# Altium project PDB_V1.0_Mother.PrjPcb
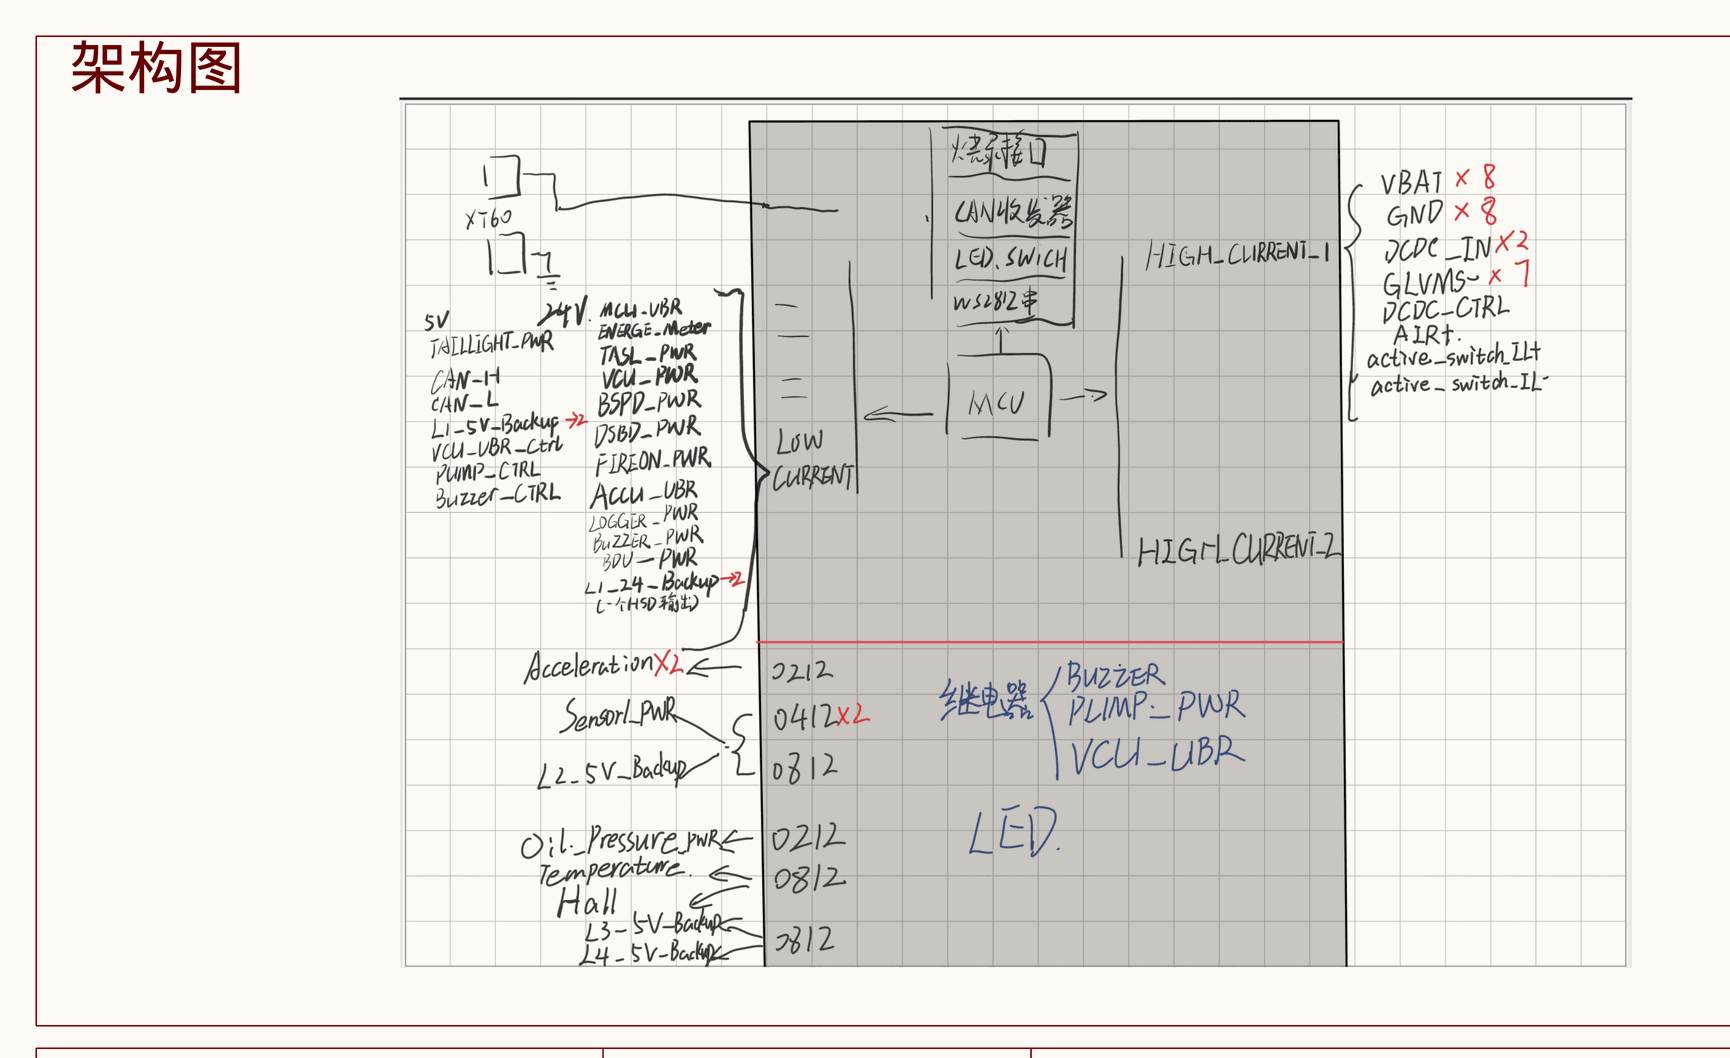
[diagram p0: PDB_Sheet2.SchDoc, top left]
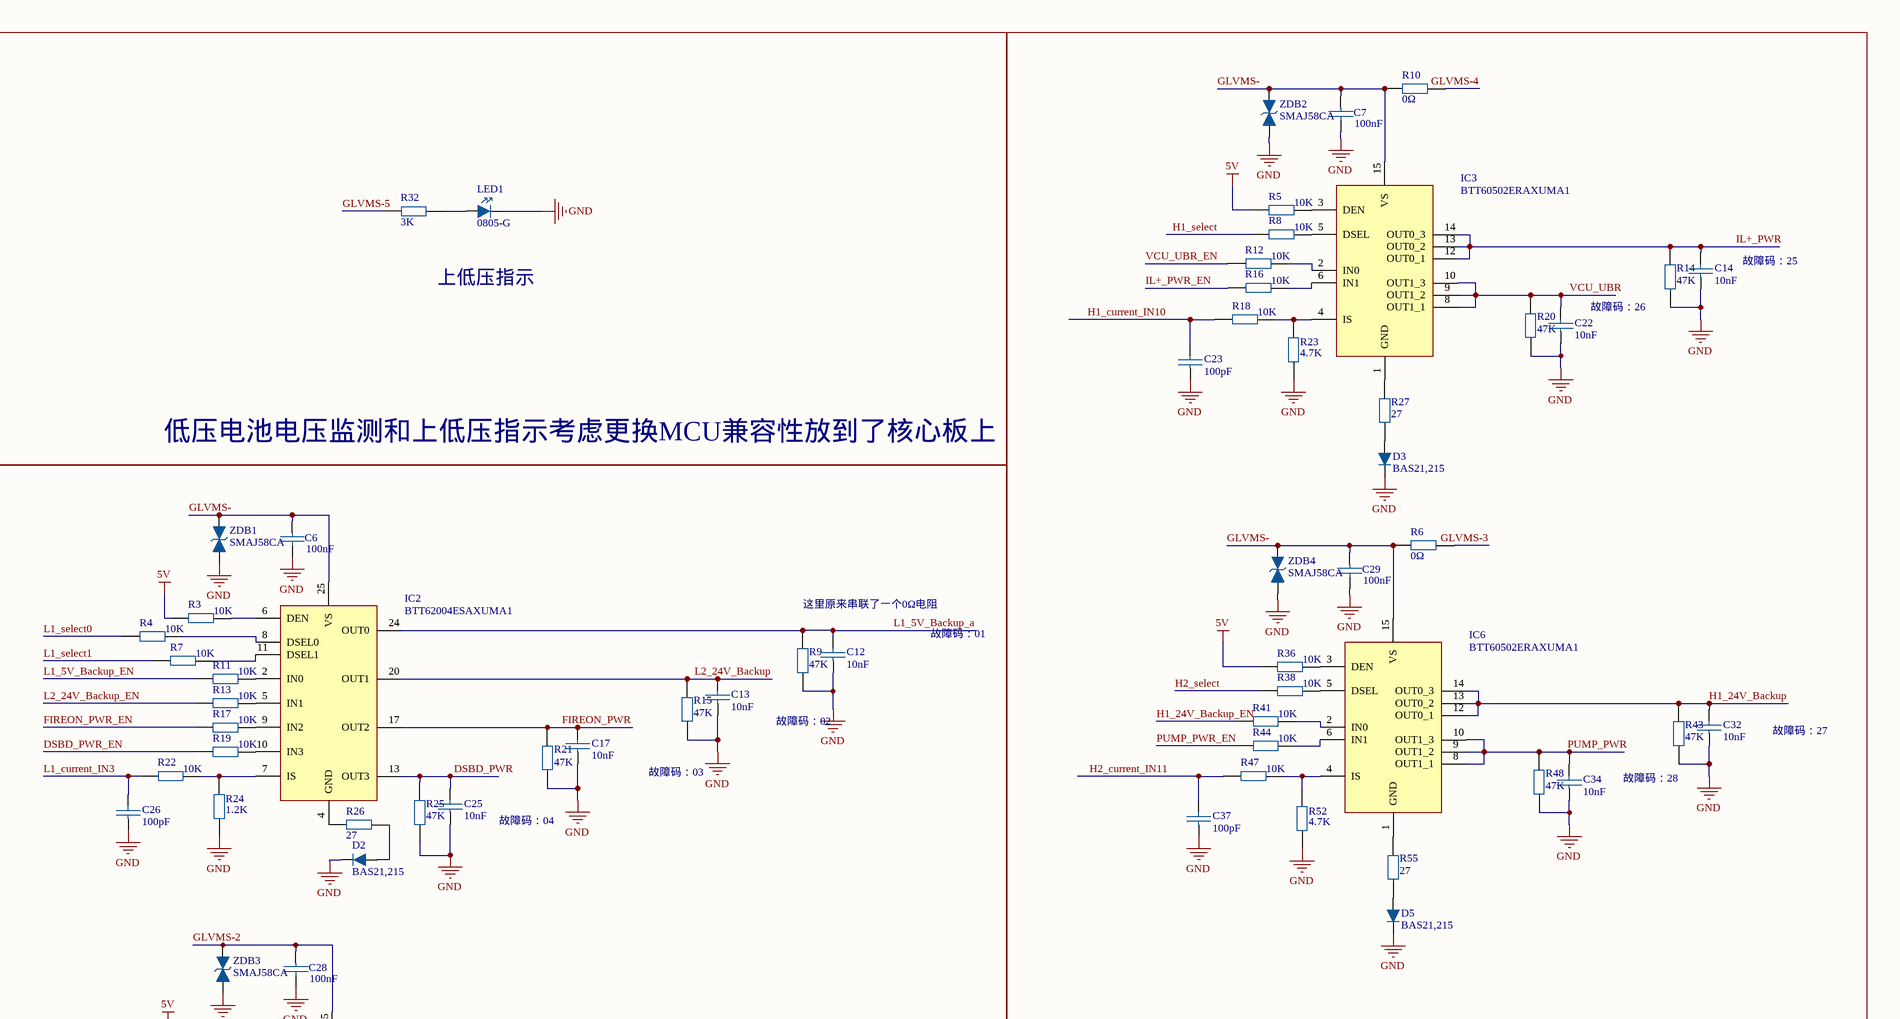
[diagram p1: PDB_Sheet2.SchDoc, top right]
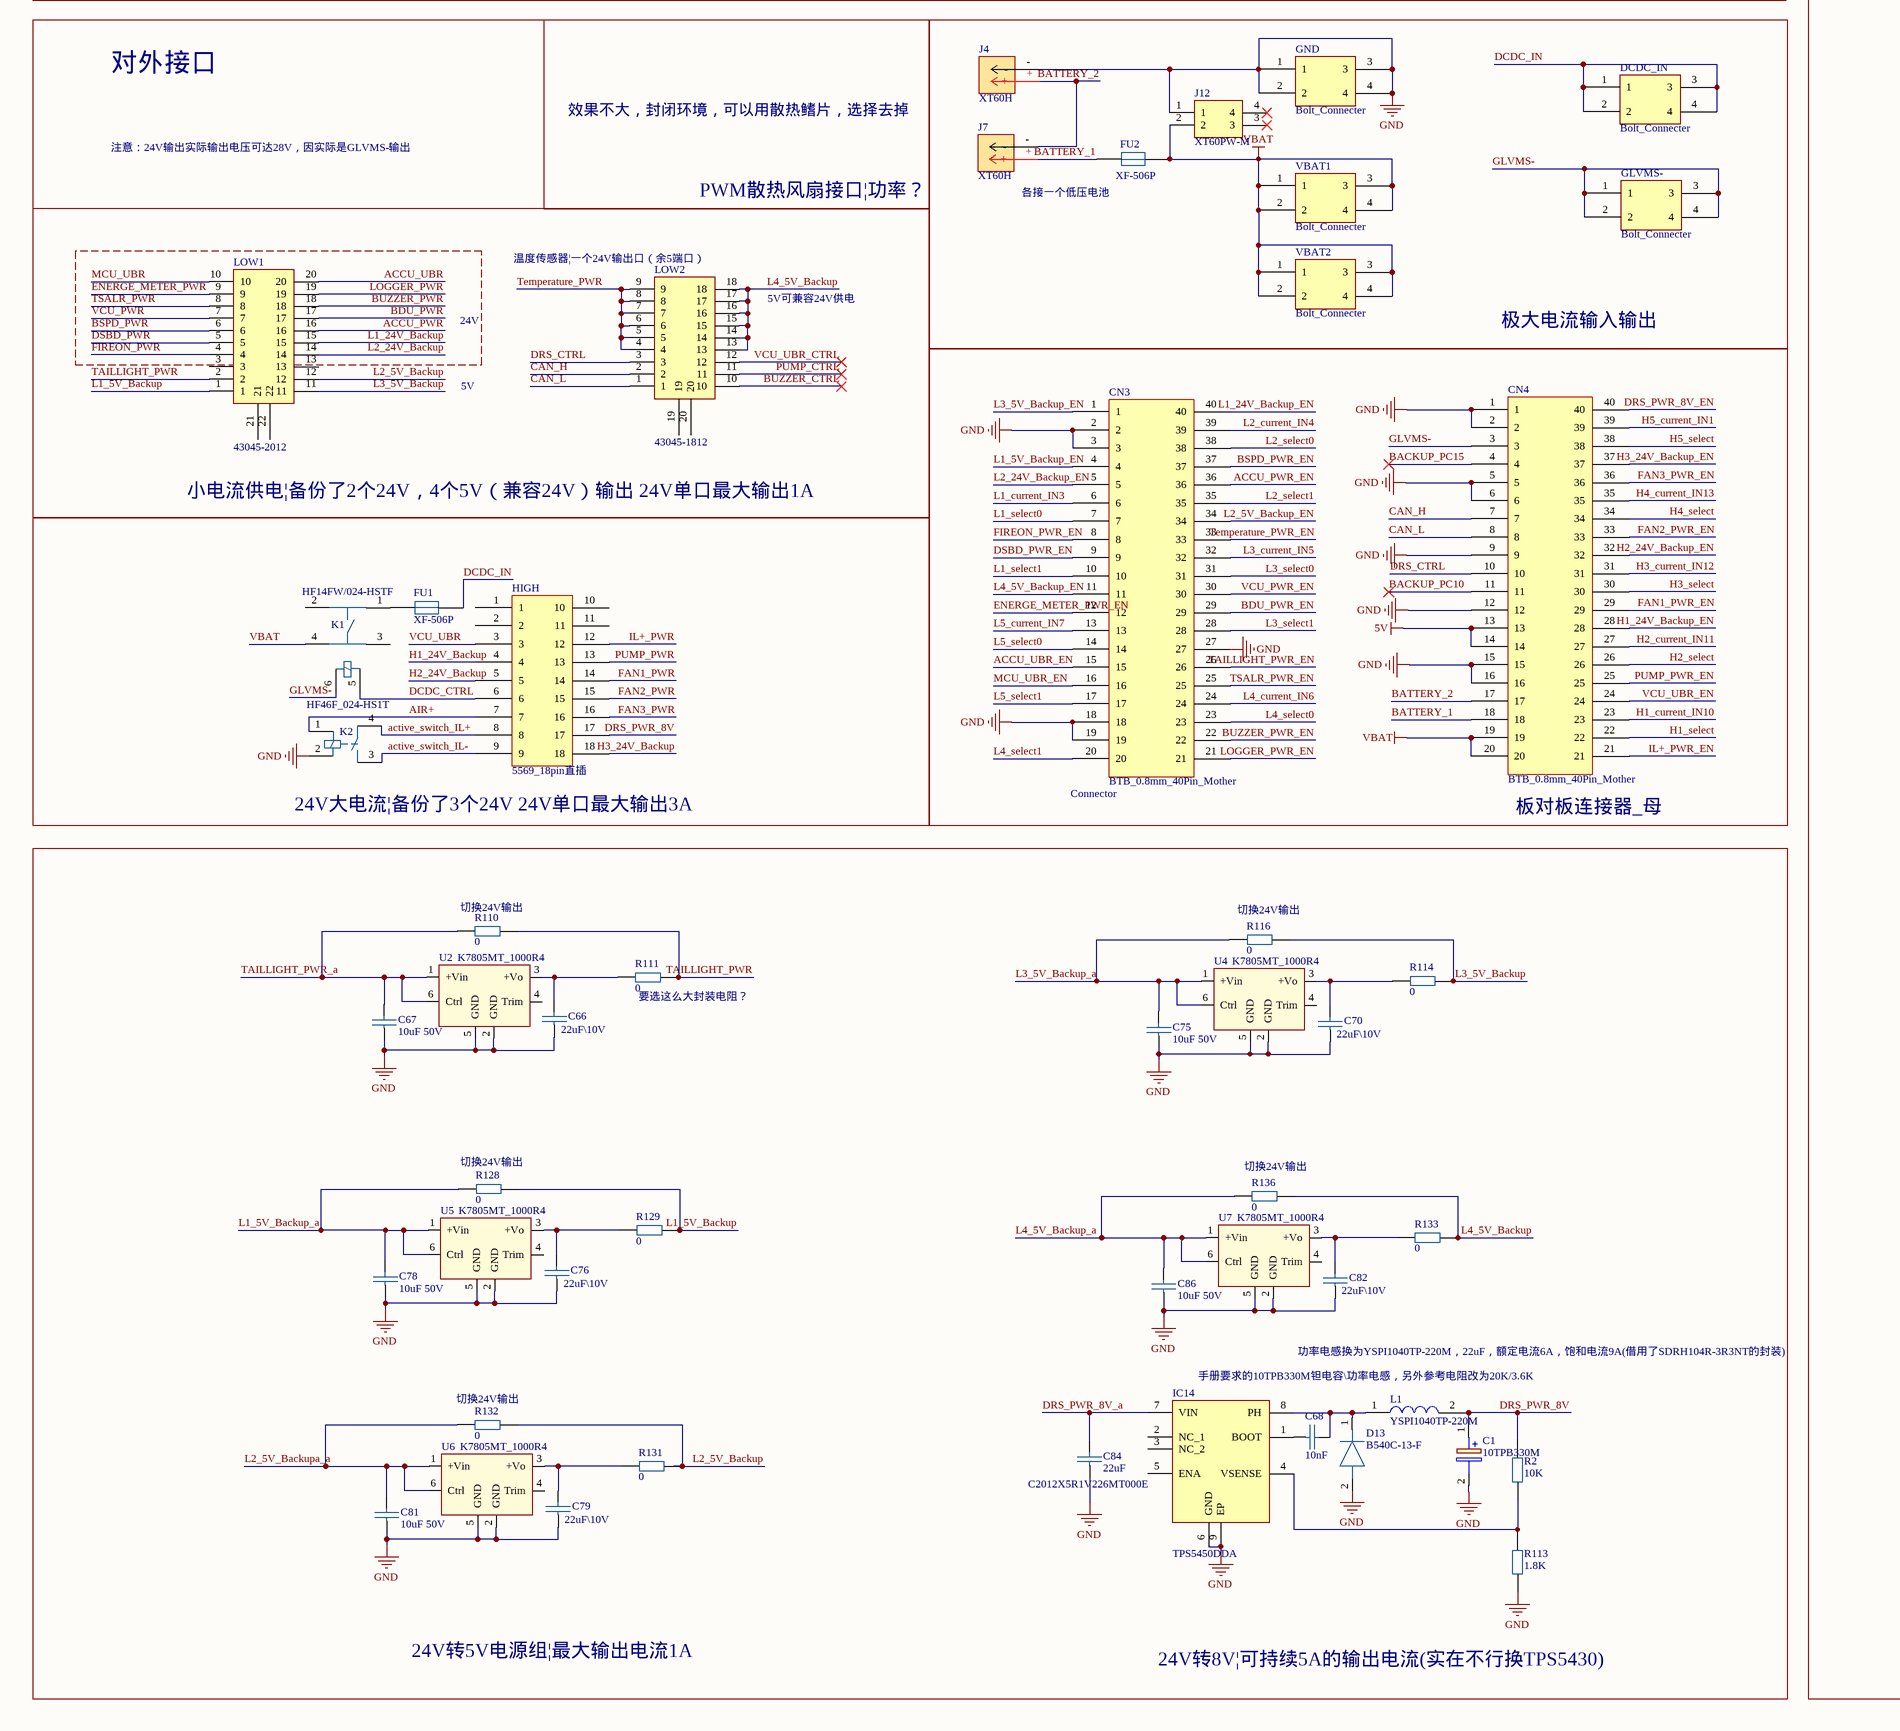
[diagram p2: PDB_Sheet2.SchDoc, bottom left]
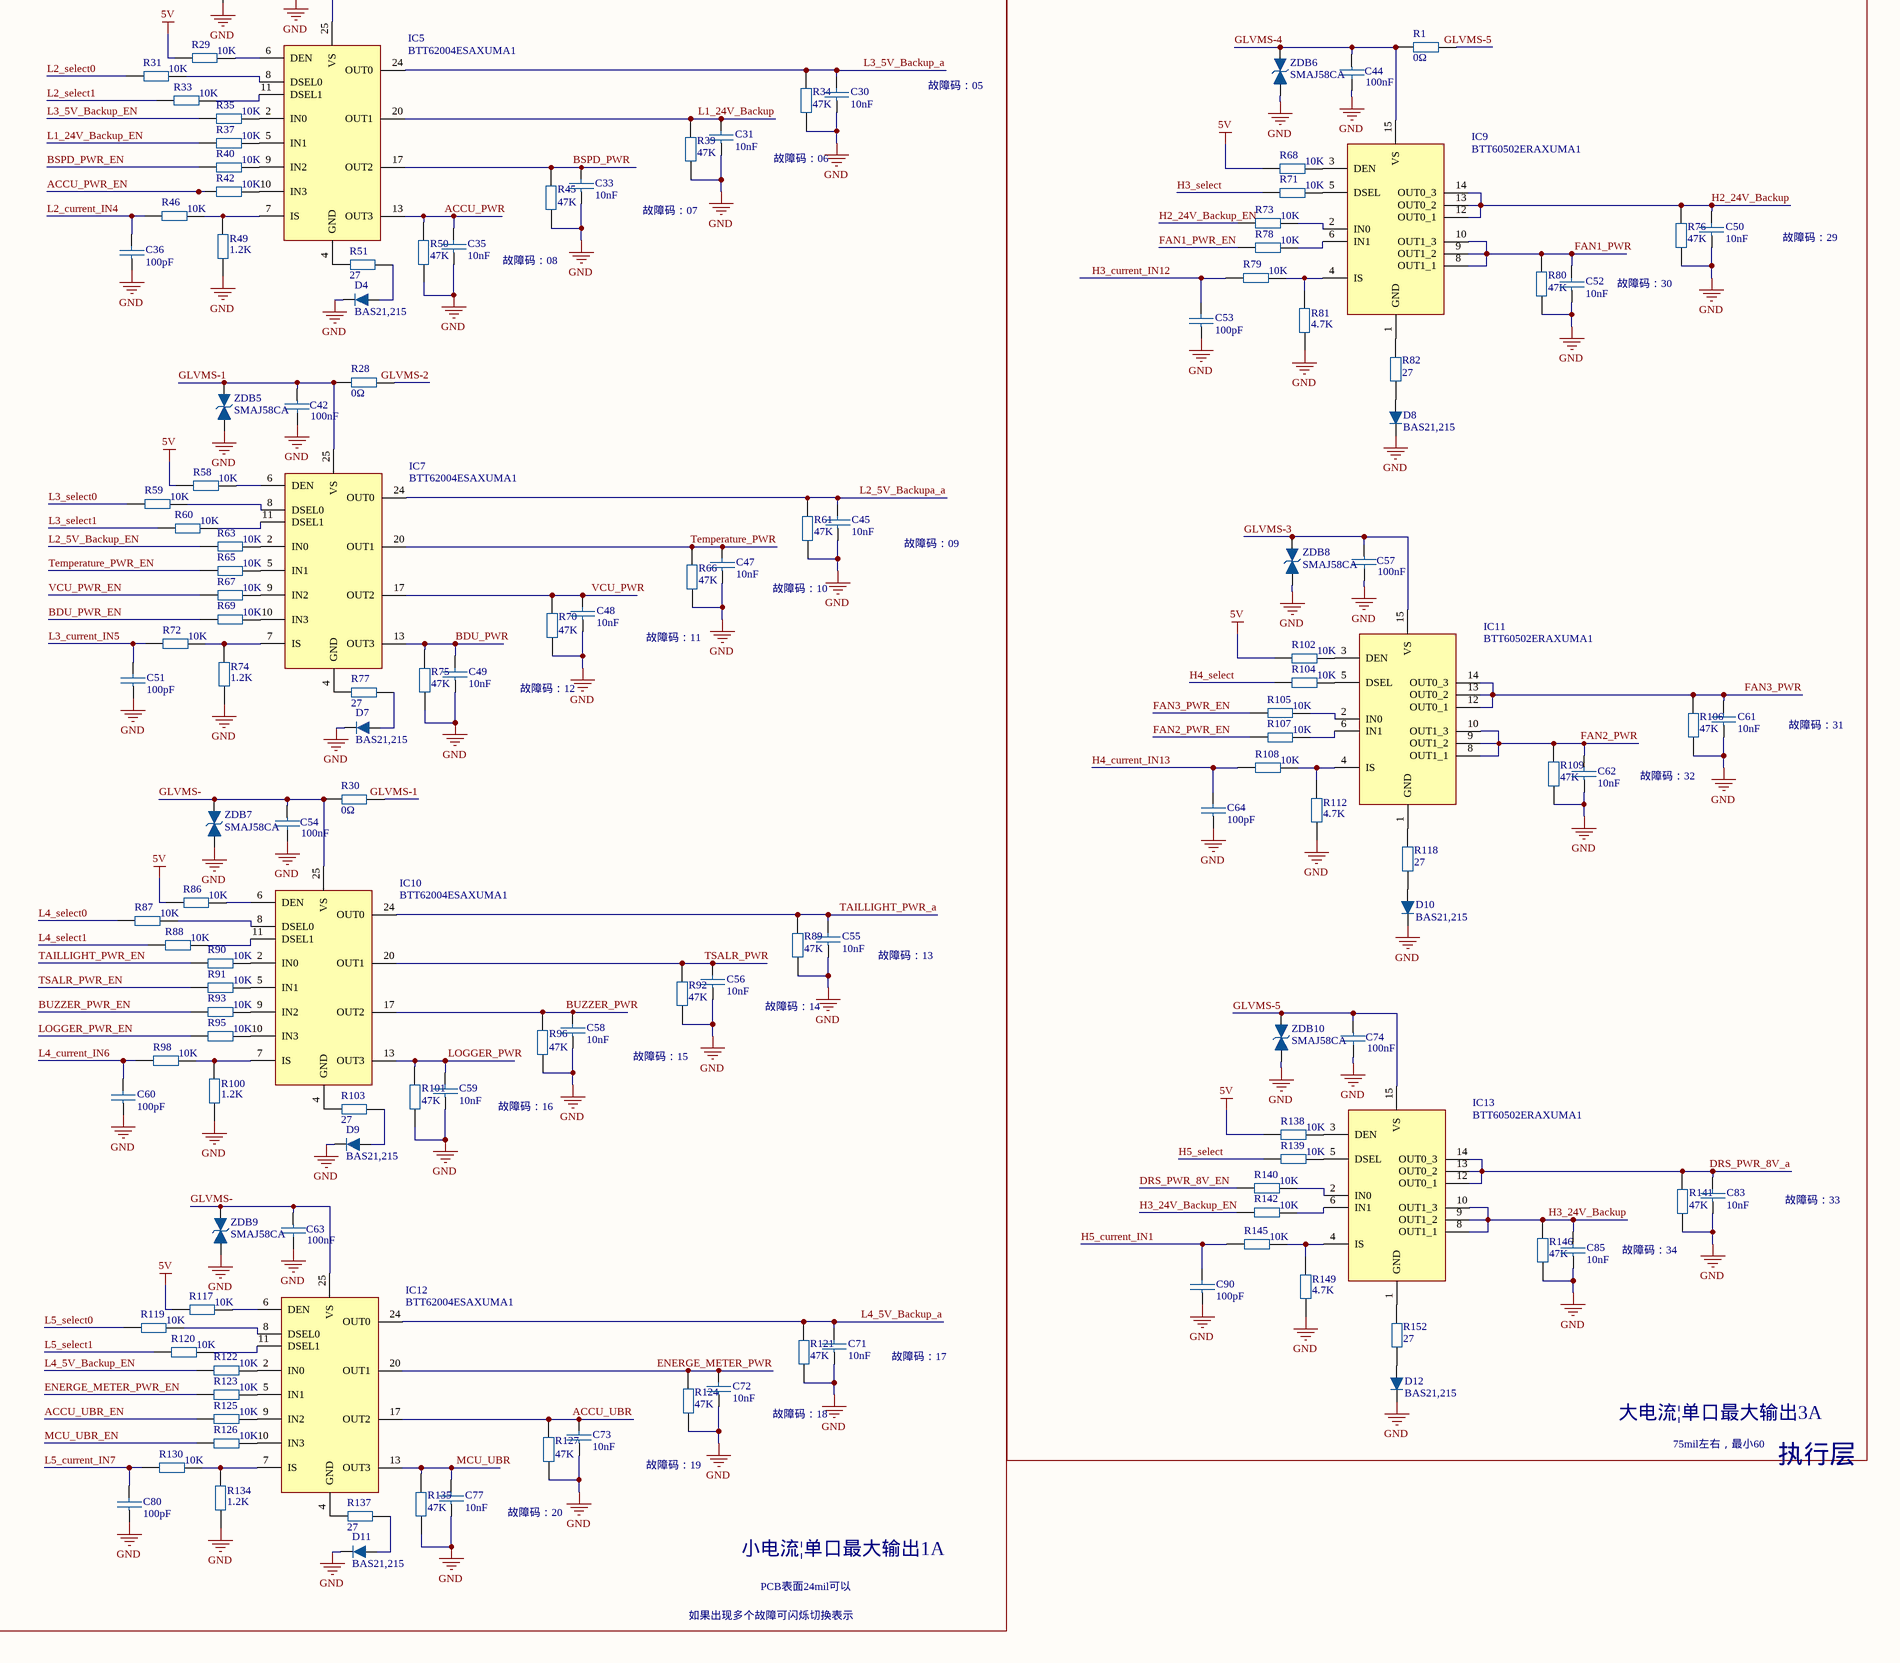
[diagram p3: PDB_Sheet2.SchDoc, bottom right]
1 sheet, 252 parts. Net scope: global (net labels, ports and power ports of the same name join across sheets).
Board file: PDB_PCB2.PcbDoc

## Sheet PDB_Sheet2.SchDoc: PDB1.0_Mother
size A1; SheetNumber: 1; SheetTotal: 1

### Parts
C1  10TPB330M  [POSCAP_D12_D15_D15E_D2E_D2_D3L_D4]
C6  100nF  [CAPC1608X08N__0603CAPUNPOLE]
C7  100nF  [CAPC1608X08N__0603CAPUNPOLE]
C12  10nF  [CAPC1608X08N__0603CAPUNPOLE]
C13  10nF  [CAPC1608X08N__0603CAPUNPOLE]
C14  10nF  [CAPC1608X08N__0603CAPUNPOLE]
C17  10nF  [CAPC1608X08N__0603CAPUNPOLE]
C22  10nF  [CAPC1608X08N__0603CAPUNPOLE]
C23  100pF  [CAPC1608X08N__0603CAPUNPOLE]
C25  10nF  [CAPC1608X08N__0603CAPUNPOLE]
C26  100pF  [CAPC1608X08N__0603CAPUNPOLE]
C28  100nF  [CAPC1608X08N__0603CAPUNPOLE]
C29  100nF  [CAPC1608X08N__0603CAPUNPOLE]
C30  10nF  [CAPC1608X08N__0603CAPUNPOLE]
C31  10nF  [CAPC1608X08N__0603CAPUNPOLE]
C32  10nF  [CAPC1608X08N__0603CAPUNPOLE]
C33  10nF  [CAPC1608X08N__0603CAPUNPOLE]
C34  10nF  [CAPC1608X08N__0603CAPUNPOLE]
C35  10nF  [CAPC1608X08N__0603CAPUNPOLE]
C36  100pF  [CAPC1608X08N__0603CAPUNPOLE]
C37  100pF  [CAPC1608X08N__0603CAPUNPOLE]
C42  100nF  [CAPC1608X08N__0603CAPUNPOLE]
C44  100nF  [CAPC1608X08N__0603CAPUNPOLE]
C45  10nF  [CAPC1608X08N__0603CAPUNPOLE]
C47  10nF  [CAPC1608X08N__0603CAPUNPOLE]
C48  10nF  [CAPC1608X08N__0603CAPUNPOLE]
C49  10nF  [CAPC1608X08N__0603CAPUNPOLE]
C50  10nF  [CAPC1608X08N__0603CAPUNPOLE]
C51  100pF  [CAPC1608X08N__0603CAPUNPOLE]
C52  10nF  [CAPC1608X08N__0603CAPUNPOLE]
C53  100pF  [CAPC1608X08N__0603CAPUNPOLE]
C54  100nF  [CAPC1608X08N__0603CAPUNPOLE]
C55  10nF  [CAPC1608X08N__0603CAPUNPOLE]
C56  10nF  [CAPC1608X08N__0603CAPUNPOLE]
C57  100nF  [CAPC1608X08N__0603CAPUNPOLE]
C58  10nF  [CAPC1608X08N__0603CAPUNPOLE]
C59  10nF  [CAPC1608X08N__0603CAPUNPOLE]
C60  100pF  [CAPC1608X08N__0603CAPUNPOLE]
C61  10nF  [CAPC1608X08N__0603CAPUNPOLE]
C62  10nF  [CAPC1608X08N__0603CAPUNPOLE]
C63  100nF  [CAPC1608X08N__0603CAPUNPOLE]
C64  100pF  [CAPC1608X08N__0603CAPUNPOLE]
C66  22uF\10V  [CAPC1608X08N__0603CAPUNPOLE]
C67  10uF 50V  [CAPC3216X16N_1206CAPUNPOLE]
C68  10nF  [CAPC1608X08N__0603CAPUNPOLE]
C70  22uF\10V  [CAPC1608X08N__0603CAPUNPOLE]
C71  10nF  [CAPC1608X08N__0603CAPUNPOLE]
C72  10nF  [CAPC1608X08N__0603CAPUNPOLE]
C73  10nF  [CAPC1608X08N__0603CAPUNPOLE]
C74  100nF  [CAPC1608X08N__0603CAPUNPOLE]
C75  10uF 50V  [CAPC3216X16N_1206CAPUNPOLE]
C76  22uF\10V  [CAPC1608X08N__0603CAPUNPOLE]
C77  10nF  [CAPC1608X08N__0603CAPUNPOLE]
C78  10uF 50V  [CAPC3216X16N_1206CAPUNPOLE]
C79  22uF\10V  [CAPC1608X08N__0603CAPUNPOLE]
C80  100pF  [CAPC1608X08N__0603CAPUNPOLE]
C81  10uF 50V  [CAPC3216X16N_1206CAPUNPOLE]
C82  22uF\10V  [CAPC1608X08N__0603CAPUNPOLE]
C83  10nF  [CAPC1608X08N__0603CAPUNPOLE]
C84  22uF  [CAPC2012X06N__0805CAPUNPOLE]
C85  10nF  [CAPC1608X08N__0603CAPUNPOLE]
C86  10uF 50V  [CAPC3216X16N_1206CAPUNPOLE]
C90  100pF  [CAPC1608X08N__0603CAPUNPOLE]
CN3  BTB_0.8mm_40Pin_Mother  System: Connector  [BTB_0.8mm_40PIN_M]
CN4  BTB_0.8mm_40Pin_Mother  [BTB_0.8mm_40PIN_M]
D2  BAS21,215  [BAS21215]
D3  BAS21,215  [BAS21215]
D4  BAS21,215  [BAS21215]
D5  BAS21,215  [BAS21215]
D7  BAS21,215  [BAS21215]
D8  BAS21,215  [BAS21215]
D9  BAS21,215  [BAS21215]
D10  BAS21,215  [BAS21215]
D11  BAS21,215  [BAS21215]
D12  BAS21,215  [BAS21215]
D13  B540C-13-F  [DIOM7959X250N]
DCDC_IN  Bolt_Connecter  [Bolt_Connecter]
FU1  XF-506P  [XF-506P]
FU2  XF-506P  [XF-506P]
GLVMS-  Bolt_Connecter  [Bolt_Connecter]
GND  Bolt_Connecter  [Bolt_Connecter]
HIGH  5569_18pin直插  [5569_18Pin]
IC2  BTT62004ESAXUMA1  [PG-TSDSO-24]
IC3  BTT60502ERAXUMA1  [PG-TDSO-14]
IC5  BTT62004ESAXUMA1  [PG-TSDSO-24]
IC6  BTT60502ERAXUMA1  [PG-TDSO-14]
IC7  BTT62004ESAXUMA1  [PG-TSDSO-24]
IC9  BTT60502ERAXUMA1  [PG-TDSO-14]
IC10  BTT62004ESAXUMA1  [PG-TSDSO-24]
IC11  BTT60502ERAXUMA1  [PG-TDSO-14]
IC12  BTT62004ESAXUMA1  [PG-TSDSO-24]
IC13  BTT60502ERAXUMA1  [PG-TDSO-14]
IC14  TPS5450DDA  [SOIC127P600X170-9N]
J4  XT60H  [AMASS_XT60_NOMAL]
J7  XT60H  [AMASS_XT60_NOMAL]
J12  XT60PW-M  [XT60PWM]
K1  HF14FW/024-HSTF  [HF14FW005HPTF]
K2  HF46F_024-HS1T  [HF46F024HS1T]
L1  YSPI1040TP-220M  [SDRH104R3R3NT]
LED1  0805-G  [DIOC2012X11N__0805DIO]
LOW1  43045-2012  [43045-20YY_121314]
LOW2  43045-1812  [43045-18YY_121314]
R1  0Ω  [RESC6432X06N__2512RES]
R2  10K  [RESC1608X04N_0603RES]
R3  10K  [RESC1608X04N_0603RES]
R4  10K  [RESC1608X04N_0603RES]
R5  10K  [RESC1608X04N_0603RES]
R6  0Ω  [RESC6432X06N__2512RES]
R7  10K  [RESC1608X04N_0603RES]
R8  10K  [RESC1608X04N_0603RES]
R9  47K  [RESC1608X04N_0603RES]
R10  0Ω  [RESC6432X06N__2512RES]
R11  10K  [RESC1608X04N_0603RES]
R12  10K  [RESC1608X04N_0603RES]
R13  10K  [RESC1608X04N_0603RES]
R14  47K  [RESC1608X04N_0603RES]
R15  47K  [RESC1608X04N_0603RES]
R16  10K  [RESC1608X04N_0603RES]
R17  10K  [RESC1608X04N_0603RES]
R18  10K  [RESC1608X04N_0603RES]
R19  10K  [RESC1608X04N_0603RES]
R20  47K  [RESC1608X04N_0603RES]
R21  47K  [RESC1608X04N_0603RES]
R22  10K  [RESC1608X04N_0603RES]
R23  4.7K  [RESC1608X04N_0603RES]
R24  1.2K  [RESC1608X04N_0603RES]
R25  47K  [RESC1608X04N_0603RES]
R26  27  [RESC1608X04N_0603RES]
R27  27  [RESC1608X04N_0603RES]
R28  0Ω  [RESC6432X06N__2512RES]
R29  10K  [RESC1608X04N_0603RES]
R30  0Ω  [RESC6432X06N__2512RES]
R31  10K  [RESC1608X04N_0603RES]
R32  3K  [RESC1608X04N_0603RES]
R33  10K  [RESC1608X04N_0603RES]
R34  47K  [RESC1608X04N_0603RES]
R35  10K  [RESC1608X04N_0603RES]
R36  10K  [RESC1608X04N_0603RES]
R37  10K  [RESC1608X04N_0603RES]
R38  10K  [RESC1608X04N_0603RES]
R39  47K  [RESC1608X04N_0603RES]
R40  10K  [RESC1608X04N_0603RES]
R41  10K  [RESC1608X04N_0603RES]
R42  10K  [RESC1608X04N_0603RES]
R43  47K  [RESC1608X04N_0603RES]
R44  10K  [RESC1608X04N_0603RES]
R45  47K  [RESC1608X04N_0603RES]
R46  10K  [RESC1608X04N_0603RES]
R47  10K  [RESC1608X04N_0603RES]
R48  47K  [RESC1608X04N_0603RES]
R49  1.2K  [RESC1608X04N_0603RES]
R50  47K  [RESC1608X04N_0603RES]
R51  27  [RESC1608X04N_0603RES]
R52  4.7K  [RESC1608X04N_0603RES]
R55  27  [RESC1608X04N_0603RES]
R58  10K  [RESC1608X04N_0603RES]
R59  10K  [RESC1608X04N_0603RES]
R60  10K  [RESC1608X04N_0603RES]
R61  47K  [RESC1608X04N_0603RES]
R63  10K  [RESC1608X04N_0603RES]
R65  10K  [RESC1608X04N_0603RES]
R66  47K  [RESC1608X04N_0603RES]
R67  10K  [RESC1608X04N_0603RES]
R68  10K  [RESC1608X04N_0603RES]
R69  10K  [RESC1608X04N_0603RES]
R70  47K  [RESC1608X04N_0603RES]
R71  10K  [RESC1608X04N_0603RES]
R72  10K  [RESC1608X04N_0603RES]
R73  10K  [RESC1608X04N_0603RES]
R74  1.2K  [RESC1608X04N_0603RES]
R75  47K  [RESC1608X04N_0603RES]
R76  47K  [RESC1608X04N_0603RES]
R77  27  [RESC1608X04N_0603RES]
R78  10K  [RESC1608X04N_0603RES]
R79  10K  [RESC1608X04N_0603RES]
R80  47K  [RESC1608X04N_0603RES]
R81  4.7K  [RESC1608X04N_0603RES]
R82  27  [RESC1608X04N_0603RES]
R86  10K  [RESC1608X04N_0603RES]
R87  10K  [RESC1608X04N_0603RES]
R88  10K  [RESC1608X04N_0603RES]
R89  47K  [RESC1608X04N_0603RES]
R90  10K  [RESC1608X04N_0603RES]
R91  10K  [RESC1608X04N_0603RES]
R92  47K  [RESC1608X04N_0603RES]
R93  10K  [RESC1608X04N_0603RES]
R95  10K  [RESC1608X04N_0603RES]
R96  47K  [RESC1608X04N_0603RES]
R98  10K  [RESC1608X04N_0603RES]
R100  1.2K  [RESC1608X04N_0603RES]
R101  47K  [RESC1608X04N_0603RES]
R102  10K  [RESC1608X04N_0603RES]
R103  27  [RESC1608X04N_0603RES]
R104  10K  [RESC1608X04N_0603RES]
R105  10K  [RESC1608X04N_0603RES]
R106  47K  [RESC1608X04N_0603RES]
R107  10K  [RESC1608X04N_0603RES]
R108  10K  [RESC1608X04N_0603RES]
R109  47K  [RESC1608X04N_0603RES]
R110  0  [RESC6432X06N__2512RES]
R111  0  [RESC6432X06N__2512RES]
R112  4.7K  [RESC1608X04N_0603RES]
R113  1.8K  [RESC1608X04N_0603RES]
R114  0  [RESC6432X06N__2512RES]
R116  0  [RESC6432X06N__2512RES]
R117  10K  [RESC1608X04N_0603RES]
R118  27  [RESC1608X04N_0603RES]
R119  10K  [RESC1608X04N_0603RES]
R120  10K  [RESC1608X04N_0603RES]
R121  47K  [RESC1608X04N_0603RES]
R122  10K  [RESC1608X04N_0603RES]
R123  10K  [RESC1608X04N_0603RES]
R124  47K  [RESC1608X04N_0603RES]
R125  10K  [RESC1608X04N_0603RES]
R126  10K  [RESC1608X04N_0603RES]
R127  47K  [RESC1608X04N_0603RES]
R128  0  [RESC6432X06N__2512RES]
R129  0  [RESC6432X06N__2512RES]
R130  10K  [RESC1608X04N_0603RES]
R131  0  [RESC6432X06N__2512RES]
R132  0  [RESC6432X06N__2512RES]
R133  0  [RESC6432X06N__2512RES]
R134  1.2K  [RESC1608X04N_0603RES]
R135  47K  [RESC1608X04N_0603RES]
R136  0  [RESC6432X06N__2512RES]
R137  27  [RESC1608X04N_0603RES]
R138  10K  [RESC1608X04N_0603RES]
R139  10K  [RESC1608X04N_0603RES]
R140  10K  [RESC1608X04N_0603RES]
R141  47K  [RESC1608X04N_0603RES]
R142  10K  [RESC1608X04N_0603RES]
R145  10K  [RESC1608X04N_0603RES]
R146  47K  [RESC1608X04N_0603RES]
R149  4.7K  [RESC1608X04N_0603RES]
R152  27  [RESC1608X04N_0603RES]
U2  K7805MT_1000R4  [K7805MT_500R4]
U4  K7805MT_1000R4  [K7805MT_500R4]
U5  K7805MT_1000R4  [K7805MT_500R4]
U6  K7805MT_1000R4  [K7805MT_500R4]
U7  K7805MT_1000R4  [K7805MT_500R4]
VBAT1  Bolt_Connecter  [Bolt_Connecter]
VBAT2  Bolt_Connecter  [Bolt_Connecter]
ZDB1  SMAJ58CA  [SMA/DO214AC-BIPOLAR]
ZDB2  SMAJ58CA  [SMA/DO214AC-BIPOLAR]
ZDB3  SMAJ58CA  [SMA/DO214AC-BIPOLAR]
ZDB4  SMAJ58CA  [SMA/DO214AC-BIPOLAR]
ZDB5  SMAJ58CA  [SMA/DO214AC-BIPOLAR]
ZDB6  SMAJ58CA  [SMA/DO214AC-BIPOLAR]
ZDB7  SMAJ58CA  [SMA/DO214AC-BIPOLAR]
ZDB8  SMAJ58CA  [SMA/DO214AC-BIPOLAR]
ZDB9  SMAJ58CA  [SMA/DO214AC-BIPOLAR]
ZDB10  SMAJ58CA  [SMA/DO214AC-BIPOLAR]

### Blocks framed on the sheet
低压电池电压监测和上低压指示考虑更换MCU兼容性放到了核心板上: LED1 R32
大电流¦单口最大输出3A: C7 C14 C22 C23 C29 C32 C34 C37 C44 C50 C52 C53 C57 C61 C62 C64 C74 C83 C85 C90 D3 D5 D8 D10 D12 IC3 IC6 IC9 IC11 IC13 R1 R5 R6 R8 R10 R12 R14 R16 R18 R20 R23 R27 R36 R38 R41 R43 R44 R47 R48 R52 R55 R68 R71 R73 R76 R78-R82 R102 R104-R109 R112 R118 R138-R142 R145 R146 R149 R152 ZDB2 ZDB4 ZDB6 ZDB8 ZDB10
小电流¦单口最大输出1A: C6 C12 C13 C17 C25 C26 C28 C30 C31 C33 C35 C36 C42 C45 C47-C49 C51 C54-C56 C58-C60 C63 C71-C73 C77 C80 D2 D4 D7 D9 D11 IC2 IC5 IC7 IC10 IC12 R3 R4 R7 R9 R11 R13 R15 R17 R19 R21 R22 R24-R26 R28-R31 R33-R35 R37 R39 R40 R42 R45 R46 R49-R51 R58-R61 R63 R65-R67 R69 R70 R72 R74 R75 R77 R86-R93 R95 R96 R98 R100 R101 R103 R117 R119-R127 R130 R134 R135 R137 ZDB1 ZDB3 ZDB5 ZDB7 ZDB9
对外接口: FU1 HIGH K1 K2 LOW2
极大电流输入输出: DCDC_IN FU2 GLVMS- GND J4 J7 J12 VBAT1 VBAT2
24V: LOW1
板对板连接器_母: CN3 CN4

### Nets
5V: CN4.13 CN4.14 R3.2 R5.2 R29.2 R36.2 R58.2 R68.2 R86.2 R102.2 R117.2 R138.2
GND: C1.2(-) C6.2 C7.2 C12.1 C13.1 C14.1 C17.1 C22.1 C23.1 C25.1 C26.1 C28.2 C29.2 C30.1 C31.1 C32.1 C33.1 C34.1 C35.1 C36.1 C37.1 C42.2 C44.2 C45.1 C47.1 C48.1 C49.1 C50.1 C51.1 C52.1 C53.1 C54.2 C55.1 C56.1 C57.2 C58.1 C59.1 C60.1 C61.1 C62.1 C63.2 C64.1 C66.1 C67.1 C70.1 C71.1 C72.1 C73.1 C74.2 C75.1 C76.1 C77.1 C78.1 C79.1 C80.1 C81.1 C82.1 C83.1 C84.1 C85.1 C86.1 C90.1 CN3.2 CN3.3 CN3.18 CN3.19 CN3.27 CN4.1 CN4.2 CN4.5 CN4.6 CN4.9 CN4.12 CN4.15 CN4.16 D2.3(K) D3.3(K) D4.3(K) D5.3(K) D7.3(K) D8.3(K) D9.3(K) D10.3(K) D11.3(K) D12.3(K) D13.2 GND.1 GND.2 GND.3 GND.4 IC14.6(GND) IC14.9(EP) J4.- J12.1 K2.2(COIL_2) LED1.1 R9.1 R14.1 R15.1 R20.1 R21.1 R23.1 R24.1 R25.1 R34.1 R39.1 R43.1 R45.1 R48.1 R49.1 R50.1 R52.1 R61.1 R66.1 R70.1 R74.1 R75.1 R76.1 R80.1 R81.1 R89.1 R92.1 R96.1 R100.1 R101.1 R106.1 R109.1 R112.1 R113.1 R121.1 R124.1 R127.1 R134.1 R135.1 R141.1 R146.1 R149.1 U2.2(GND) U2.5(GND) U4.2(GND) U4.5(GND) U5.2(GND) U5.5(GND) U6.2(GND) U6.5(GND) U7.2(GND) U7.5(GND) ZDB1.1 ZDB2.1 ZDB3.1 ZDB4.1 ZDB5.1 ZDB6.1 ZDB7.1 ZDB8.1 ZDB9.1 ZDB10.1
VBAT: CN4.19 CN4.20 FU2.2 J12.2 K1.4(COM_2) VBAT1.1 VBAT1.2 VBAT1.3 VBAT1.4 VBAT2.1 VBAT2.2 VBAT2.3 VBAT2.4
ACCU_PWR: C35.2 IC5.13(OUT3) LOW1.16 R50.2
ACCU_PWR_EN: CN3.36 R42.2
ACCU_UBR: C73.2 IC12.17(OUT2) LOW1.20 R127.2
ACCU_UBR_EN: CN3.15 R125.2
active_switch_IL+: HIGH.8 K2.4(COM)
active_switch_IL-: HIGH.9 K2.3(NO)
AIR+: HIGH.7 K2.1(COIL_1)
BACKUP_PC10: CN4.11
BACKUP_PC15: CN4.4
BATTERY_1: CN4.18 FU2.1 J7.+
BATTERY_2: CN4.17 J4.+ J7.-
BDU_PWR: C49.2 IC7.13(OUT3) LOW1.17 R75.2
BDU_PWR_EN: CN3.29 R69.2
BSPD_PWR: C33.2 IC5.17(OUT2) LOW1.6 R45.2
BSPD_PWR_EN: CN3.37 R40.2
BUZZER_CTRL: LOW2.10
BUZZER_PWR: C58.2 IC10.17(OUT2) LOW1.18 R96.2
BUZZER_PWR_EN: CN3.22 R93.2
CAN_H: CN4.7 LOW2.2
CAN_L: CN4.8 LOW2.1
DCDC_CTRL: HIGH.6 K1.5(COIL_1)
DCDC_IN: DCDC_IN.1 DCDC_IN.2 DCDC_IN.3 DCDC_IN.4 FU1.1
DRS_CTRL: CN4.10 LOW2.3
DRS_PWR_8V: C1.1(+) HIGH.17 L1.2 R2.2
DRS_PWR_8V_a: C83.2 C84.2 IC13.12(OUT0_1) IC13.13(OUT0_2) IC13.14(OUT0_3) IC14.7(VIN) R141.2
DRS_PWR_8V_EN: CN4.40 R140.2
DSBD_PWR: C25.2 IC2.13(OUT3) LOW1.5 R25.2
DSBD_PWR_EN: CN3.9 R19.2
ENERGE_METER_PWR: C72.2 IC12.20(OUT1) LOW1.9 R124.2
ENERGE_METER_PWR_EN: CN3.12 R123.2
FAN1_PWR: C52.2 HIGH.14 IC9.8(OUT1_1) IC9.9(OUT1_2) IC9.10(OUT1_3) R80.2
FAN1_PWR_EN: CN4.29 R78.2
FAN2_PWR: C62.2 HIGH.15 IC11.8(OUT1_1) IC11.9(OUT1_2) IC11.10(OUT1_3) R109.2
FAN2_PWR_EN: CN4.33 R107.2
FAN3_PWR: C61.2 HIGH.16 IC11.12(OUT0_1) IC11.13(OUT0_2) IC11.14(OUT0_3) R106.2
FAN3_PWR_EN: CN4.36 R105.2
FIREON_PWR: C17.2 IC2.17(OUT2) LOW1.4 R21.2
FIREON_PWR_EN: CN3.8 R17.2
GLVMS-: C6.1 C7.1 C29.1 C54.1 C63.1 CN4.3 GLVMS-.1 GLVMS-.2 GLVMS-.3 GLVMS-.4 IC2.25(VS) IC3.15(VS) IC6.15(VS) IC10.25(VS) IC12.25(VS) K1.6(COIL_2) R6.1 R10.1 R30.1 ZDB1.2 ZDB2.2 ZDB4.2 ZDB7.2 ZDB9.2
GLVMS-1: C42.1 IC7.25(VS) R28.1 R30.2 ZDB5.2
GLVMS-2: C28.1 IC5.25(VS) R28.2 ZDB3.2
GLVMS-3: C57.1 IC11.15(VS) R6.2 ZDB8.2
GLVMS-4: C44.1 IC9.15(VS) R1.1 R10.2 ZDB6.2
GLVMS-5: C74.1 IC13.15(VS) R1.2 R32.2 ZDB10.2
H1_24V_Backup: C32.2 HIGH.4 IC6.12(OUT0_1) IC6.13(OUT0_2) IC6.14(OUT0_3) R43.2
H1_24V_Backup_EN: CN4.28 R41.2
H1_current_IN10: C23.2 CN4.23 R18.2
H1_select: CN4.22 R8.2
H2_24V_Backup: C50.2 HIGH.5 IC9.12(OUT0_1) IC9.13(OUT0_2) IC9.14(OUT0_3) R76.2
H2_24V_Backup_EN: CN4.32 R73.2
H2_current_IN11: C37.2 CN4.27 R47.2
H2_select: CN4.26 R38.2
H3_24V_Backup: C85.2 HIGH.18 IC13.8(OUT1_1) IC13.9(OUT1_2) IC13.10(OUT1_3) R146.2
H3_24V_Backup_EN: CN4.37 R142.2
H3_current_IN12: C53.2 CN4.31 R79.2
H3_select: CN4.30 R71.2
H4_current_IN13: C64.2 CN4.35 R108.2
H4_select: CN4.34 R104.2
H5_current_IN1: C90.2 CN4.39 R145.2
H5_select: CN4.38 R139.2
IL+_PWR: C14.2 HIGH.12 IC3.12(OUT0_1) IC3.13(OUT0_2) IC3.14(OUT0_3) R14.2
IL+_PWR_EN: CN4.21 R16.2
L1_5V_Backup: LOW1.1 R128.2 R129.2
L1_5V_Backup_a: C12.2 C78.2 IC2.24(OUT0) R9.2 R128.1 U5.1(+Vin) U5.6(Ctrl)
L1_5V_Backup_EN: CN3.4 R11.2
L1_24V_Backup: C31.2 IC5.20(OUT1) LOW1.15 R39.2
L1_24V_Backup_EN: CN3.40 R37.2
L1_current_IN3: C26.2 CN3.6 R22.2
L1_select0: CN3.7 R4.2
L1_select1: CN3.10 R7.2
L2_5V_Backup: LOW1.12 R131.2 R132.2
L2_5V_Backup_EN: CN3.34 R63.2
L2_5V_Backupa_a: C45.2 C81.2 IC7.24(OUT0) R61.2 R132.1 U6.1(+Vin) U6.6(Ctrl)
L2_24V_Backup: C13.2 IC2.20(OUT1) LOW1.14 R15.2
L2_24V_Backup_EN: CN3.5 R13.2
L2_current_IN4: C36.2 CN3.39 R46.2
L2_select0: CN3.38 R31.2
L2_select1: CN3.35 R33.2
L3_5V_Backup: LOW1.11 R114.2 R116.2
L3_5V_Backup_a: C30.2 C75.2 IC5.24(OUT0) R34.2 R116.1 U4.1(+Vin) U4.6(Ctrl)
L3_5V_Backup_EN: CN3.1 R35.2
L3_current_IN5: C51.2 CN3.32 R72.2
L3_select0: CN3.31 R59.2
L3_select1: CN3.28 R60.2
L4_5V_Backup: LOW2.13 LOW2.14 LOW2.15 LOW2.16 LOW2.17 LOW2.18 R133.2 R136.2
L4_5V_Backup_a: C71.2 C86.2 IC12.24(OUT0) R121.2 R136.1 U7.1(+Vin) U7.6(Ctrl)
L4_5V_Backup_EN: CN3.11 R122.2
L4_current_IN6: C60.2 CN3.24 R98.2
L4_select0: CN3.23 R87.2
L4_select1: CN3.20 R88.2
L5_current_IN7: C80.2 CN3.13 R130.2
L5_select0: CN3.14 R119.2
L5_select1: CN3.17 R120.2
LOGGER_PWR: C59.2 IC10.13(OUT3) LOW1.19 R101.2
LOGGER_PWR_EN: CN3.21 R95.2
MCU_UBR: C77.2 IC12.13(OUT3) LOW1.10 R135.2
MCU_UBR_EN: CN3.16 R126.2
PUMP_CTRL: LOW2.11
PUMP_PWR: C34.2 HIGH.13 IC6.8(OUT1_1) IC6.9(OUT1_2) IC6.10(OUT1_3) R48.2
PUMP_PWR_EN: CN4.25 R44.2
TAILLIGHT_PWR: LOW1.2 R110.2 R111.2
TAILLIGHT_PWR_a: C55.2 C67.2 IC10.24(OUT0) R89.2 R110.1 U2.1(+Vin) U2.6(Ctrl)
TAILLIGHT_PWR_EN: CN3.26 R90.2
Temperature_PWR: C47.2 IC7.20(OUT1) LOW2.4 LOW2.5 LOW2.6 LOW2.7 LOW2.8 LOW2.9 R66.2
Temperature_PWR_EN: CN3.33 R65.2
TSALR_PWR: C56.2 IC10.20(OUT1) LOW1.8 R92.2
TSALR_PWR_EN: CN3.25 R91.2
VCU_PWR: C48.2 IC7.17(OUT2) LOW1.7 R70.2
VCU_PWR_EN: CN3.30 R67.2
VCU_UBR: C22.2 HIGH.3 IC3.8(OUT1_1) IC3.9(OUT1_2) IC3.10(OUT1_3) R20.2
VCU_UBR_CTRL: LOW2.12
VCU_UBR_EN: CN4.24 R12.2
NetC66_2: C66.2 R111.1 U2.3(+Vo)
NetC68_1: C68.1 IC14.1(BOOT)
NetC68_2: C68.2 D13.1 IC14.8(PH) L1.1
NetC70_2: C70.2 R114.1 U4.3(+Vo)
NetC76_2: C76.2 R129.1 U5.3(+Vo)
NetC79_2: C79.2 R131.1 U6.3(+Vo)
NetC82_2: C82.2 R133.1 U7.3(+Vo)
NetD2_1: D2.1(A) R26.1
NetD3_1: D3.1(A) R27.2
NetD4_1: D4.1(A) R51.1
NetD5_1: D5.1(A) R55.2
NetD7_1: D7.1(A) R77.1
NetD8_1: D8.1(A) R82.2
NetD9_1: D9.1(A) R103.1
NetD10_1: D10.1(A) R118.2
NetD11_1: D11.1(A) R137.1
NetD12_1: D12.1(A) R152.2
NetFU1_2: FU1.2 K1.1(NO_1)
NetIC2_2: IC2.2(IN0) R11.1
NetIC2_4: IC2.4(GND) R26.2
NetIC2_5: IC2.5(IN1) R13.1
NetIC2_6: IC2.6(DEN) R3.1
NetIC2_7: IC2.7(IS) R22.1 R24.2
NetIC2_8: IC2.8(DSEL0) R4.1
NetIC2_9: IC2.9(IN2) R17.1
NetIC2_10: IC2.10(IN3) R19.1
NetIC2_11: IC2.11(DSEL1) R7.1
NetIC3_1: IC3.1(GND) R27.1
NetIC3_2: IC3.2(IN0) R12.1
NetIC3_3: IC3.3(DEN) R5.1
NetIC3_4: IC3.4(IS) R18.1 R23.2
NetIC3_5: IC3.5(DSEL) R8.1
NetIC3_6: IC3.6(IN1) R16.1
NetIC5_2: IC5.2(IN0) R35.1
NetIC5_4: IC5.4(GND) R51.2
NetIC5_5: IC5.5(IN1) R37.1
NetIC5_6: IC5.6(DEN) R29.1
NetIC5_7: IC5.7(IS) R46.1 R49.2
NetIC5_8: IC5.8(DSEL0) R31.1
NetIC5_9: IC5.9(IN2) R40.1
NetIC5_10: IC5.10(IN3) R42.1
NetIC5_11: IC5.11(DSEL1) R33.1
NetIC6_1: IC6.1(GND) R55.1
NetIC6_2: IC6.2(IN0) R41.1
NetIC6_3: IC6.3(DEN) R36.1
NetIC6_4: IC6.4(IS) R47.1 R52.2
NetIC6_5: IC6.5(DSEL) R38.1
NetIC6_6: IC6.6(IN1) R44.1
NetIC7_2: IC7.2(IN0) R63.1
NetIC7_4: IC7.4(GND) R77.2
NetIC7_5: IC7.5(IN1) R65.1
NetIC7_6: IC7.6(DEN) R58.1
NetIC7_7: IC7.7(IS) R72.1 R74.2
NetIC7_8: IC7.8(DSEL0) R59.1
NetIC7_9: IC7.9(IN2) R67.1
NetIC7_10: IC7.10(IN3) R69.1
NetIC7_11: IC7.11(DSEL1) R60.1
NetIC9_1: IC9.1(GND) R82.1
NetIC9_2: IC9.2(IN0) R73.1
NetIC9_3: IC9.3(DEN) R68.1
NetIC9_4: IC9.4(IS) R79.1 R81.2
NetIC9_5: IC9.5(DSEL) R71.1
NetIC9_6: IC9.6(IN1) R78.1
NetIC10_2: IC10.2(IN0) R90.1
NetIC10_4: IC10.4(GND) R103.2
NetIC10_5: IC10.5(IN1) R91.1
NetIC10_6: IC10.6(DEN) R86.1
NetIC10_7: IC10.7(IS) R98.1 R100.2
NetIC10_8: IC10.8(DSEL0) R87.1
NetIC10_9: IC10.9(IN2) R93.1
NetIC10_10: IC10.10(IN3) R95.1
NetIC10_11: IC10.11(DSEL1) R88.1
NetIC11_1: IC11.1(GND) R118.1
NetIC11_2: IC11.2(IN0) R105.1
NetIC11_3: IC11.3(DEN) R102.1
NetIC11_4: IC11.4(IS) R108.1 R112.2
NetIC11_5: IC11.5(DSEL) R104.1
NetIC11_6: IC11.6(IN1) R107.1
NetIC12_2: IC12.2(IN0) R122.1
NetIC12_4: IC12.4(GND) R137.2
NetIC12_5: IC12.5(IN1) R123.1
NetIC12_6: IC12.6(DEN) R117.1
NetIC12_7: IC12.7(IS) R130.1 R134.2
NetIC12_8: IC12.8(DSEL0) R119.1
NetIC12_9: IC12.9(IN2) R125.1
NetIC12_10: IC12.10(IN3) R126.1
NetIC12_11: IC12.11(DSEL1) R120.1
NetIC13_1: IC13.1(GND) R152.1
NetIC13_2: IC13.2(IN0) R140.1
NetIC13_3: IC13.3(DEN) R138.1
NetIC13_4: IC13.4(IS) R145.1 R149.2
NetIC13_5: IC13.5(DSEL) R139.1
NetIC13_6: IC13.6(IN1) R142.1
NetIC14_4: IC14.4(VSENSE) R2.1 R113.2
NetLED1_2: LED1.2 R32.1

Not connected (* = marked no-connect by the designer): HIGH 1 2 10 11; IC14 2(NC_1) 3(NC_2) 5(ENA); J12 3* 4*; K1 2(NO_2) 3(COM_1); LOW1 3 13 21 22; LOW2 19 20; U2 4(Trim); U4 4(Trim); U5 4(Trim); U6 4(Trim); U7 4(Trim)

### Notes on the sheet
- 架构图
- (near C14) 故障码：25
- 上低压指示
- (near C22) 故障码：26
- 这里原来串联了一个0Ω电阻
- 故障码：01
- 故障码：02
- 故障码：27
- 故障码：03
- 故障码：28
- 故障码：04
- 效果不大，封闭环境，可以用散热鳍片，选择去掉
- 注意：24V输出实际输出电压可达28V，因实际是GLVMS-输出
- PWM散热风扇接口¦功率？
- (near J7) 各接一个低压电池
- 故障码：05
- (near LOW2) 温度传感器¦一个24V输出口（余5端口）
- 故障码：06
- 5V可兼容24V供电
- 故障码：07
- 故障码：29
- 故障码：08
- 故障码：30
- 5V
- 小电流供电¦备份了2个24V，4个5V（兼容24V）输出 24V单口最大输出1A
- 故障码：09
- 故障码：10
- 故障码：11
- 24V大电流¦备份了3个24V 24V单口最大输出3A
- 故障码：12
- 故障码：31
- 故障码：32
- (near R110) 切换24V输出
- (near R116) 切换24V输出
- (near R111) 要选这么大封装电阻？
- 故障码：13
- 故障码：14
- (near R128) 切换24V输出
- (near R136) 切换24V输出
- 故障码：16
- 故障码：15
- 故障码：33
- 功率电感换为YSPI1040TP-220M，22uF，额定电流6A，饱和电流9A(借用了SDRH104R-3R3NT的封装)
- 故障码：34
- (near R132) 切换24V输出
- 手册要求的10TPB330M钽电容\功率电感，另外参考电阻改为20K/3.6K
- 故障码：17
- (near C84) C2012X5R1V226MT000E
- 故障码：19
- 故障码：18
- 75mil左右，最小60
- 执行层
- 故障码：20
- 24V转5V电源组¦最大输出电流1A
- PCB表面24mil可以
- 24V转8V¦可持续5A的输出电流(实在不行换TPS5430)
- 如果出现多个故障可闪烁切换表示
- ENG:
- DSN:
- APPROVALS
- DATE
- PROJECT REVISION:
- Vehicle Number:
- E33
- DOCUMENT REVISION:
- Wuhan University of Techonology
- Formula Student Electric Racing Team
- No. 122, Luoshi Road, Wuhan
- Hubei Provence, China
- Design Item:
- CHK:
- BOM:
- REFERENCE DOCUMENTS
- TITLE
- FAB DWG:
- PCB DWG:
- ASSY DWG:
- SCALE:
- A1
- SIZE
- FILE NAME
- WUTE racing team
- SHEET
- OF
- REV

### Library data of the parts
C1 = 10TPB330M: Capacitor Polarised; Manufacturer_Name: Panasonic; Datasheet Link: http://industrial.panasonic.com/cdbs/www-data/pdf/AAA8000/AAA8000C65.pdf; Manufacturer_Part_Number: 10TPB330M; Mouser Part Number: 667-10TPB330M; Mouser Price/Stock: https://www.mouser.co.uk/ProductDetail/Panasonic/10TPB330M?qs=OE1iw1LrrPGJ%2FhG9UwG4gg%3D%3D; Arrow Part Number: 10TPB330M; Arrow Price/Stock: https://www.arrow.com/en/products/10tpb330m/panasonic?region=nac
C6 C7 C12-C14 C17 C22 C23 C25 C26 C28-C37 C42 C44 C45 C47-C64 C68 C71-C74 C77 C80 C83-C85 C90 = SMD_MLCC: Std MLCC Cap; voltage rating: ?V
  C6 C7 C28 C29 C42 C44 C54 C57 C63 C74: Type: 100nF
  C12-C14 C17 C22 C25 C30-C35 C45 C47-C50 C52 C55 C56 C58 C59 C61 C62 C68 C71-C73 C77 C83 C85: Type: 10nF
  C23 C26 C36 C37 C51 C53 C60 C64 C80 C90: Type: 100pF
  C84: Type: 22uF
C66 C67 C70 C75 C76 C78 C79 C81 C82 C86 = SMD_MLCC: Std MLCC Cap
  C66 C70 C76 C79 C82: Type: 22uF\10V
  C67 C75 C78 C81 C86: Type: 10uF 50V
CN4 = BTB_0.8mm_40Pin_Mother: System: Connector
D2-D5 D7-D12 = BAS21,215: Diode; Manufacturer_Name: Nexperia; Datasheet Link: https://assets.nexperia.com/documents/data-sheet/BAS21.pdf; Height: 1.1mm; Manufacturer_Part_Number: BAS21,215; Mouser Part Number: 771-BAS21-T/R; Mouser Price/Stock: https://www.mouser.co.uk/ProductDetail/Nexperia/BAS21215?qs=me8TqzrmIYVAUvbefFMRnQ%3D%3D; Arrow Part Number: BAS21,215; Arrow Price/Stock: https://www.arrow.com/en/products/bas21215/nexperia
D13 = B540C-13-F: Diode; Manufacturer_Name: Diodes Incorporated; Datasheet Link: https://componentsearchengine.com/Datasheets/2/B540C-13-F.pdf; Height: 2.5mm; Manufacturer_Part_Number: B540C-13-F; Mouser Part Number: 621-B540C-F; Mouser Price/Stock: https://www.mouser.co.uk/ProductDetail/Diodes-Incorporated/B540C-13-F?qs=v2dnQLbuoRZXHN%2FK4ft5%252Bg%3D%3D; Arrow Part Number: B540C-13-F; Arrow Price/Stock: https://www.arrow.com/en/products/b540c-13-f/diodes-incorporated?region=nac
FU1 FU2 = XF-506P: 小型汽车插片保险丝座
IC2 IC5 IC7 IC10 IC12 = BTT62004ESAXUMA1: Integrated Circuit; Manufacturer_Name: Infineon; Datasheet Link: https://componentsearchengine.com/Datasheets/2/BTT62004ESAXUMA1.pdf; Height: 1.15mm; Manufacturer_Part_Number: BTT62004ESAXUMA1; Mouser Part Number: 726-BTT62004ESAXUMA1; Mouser Price/Stock: https://www.mouser.co.uk/ProductDetail/Infineon-Technologies/BTT62004ESAXUMA1?qs=unwgFEO1A6tpV1sLwJtTRA%3D%3D; Arrow Part Number: BTT62004ESAXUMA1; Arrow Price/Stock: https://www.arrow.com/en/products/btt62004esaxuma1/infineon-technologies-ag
IC3 IC6 IC9 IC11 IC13 = BTT60502ERAXUMA1: Integrated Circuit; Manufacturer_Name: Infineon; Datasheet Link: https://www.infineon.com/dgdl/Infineon-BTT6050-2ERA-DS-v01_00-EN.pdf?fileId=5546d46269e1c019016a21d599df0d6a; Height: 1.15mm; Manufacturer_Part_Number: BTT60502ERAXUMA1; Mouser Part Number: 726-BTT60502ERAXUMA1; Mouser Price/Stock: https://www.mouser.co.uk/ProductDetail/Infineon-Technologies/BTT60502ERAXUMA1?qs=mAH9sUMRCtsi1%2FDCmYjCiw%3D%3D; Arrow Part Number: BTT60502ERAXUMA1; Arrow Price/Stock: https://www.arrow.com/en/products/btt60502eraxuma1/infineon-technologies-ag?region=nac
IC14 = TPS5450DDA: Integrated Circuit; Manufacturer_Name: Texas Instruments; Datasheet Link: http://www.ti.com/lit/ds/symlink/tps5450.pdf; Height: 1.7mm; Manufacturer_Part_Number: TPS5450DDA; Mouser Part Number: 595-TPS5450DDA; Mouser Price/Stock: https://www.mouser.co.uk/ProductDetail/Texas-Instruments/TPS5450DDA?qs=h%2FYsCRHtaqPow3uMxnjN5A%3D%3D; Arrow Part Number: TPS5450DDA; Arrow Price/Stock: https://www.arrow.com/en/products/tps5450dda/texas-instruments?region=nac
J4 J7 = AmassXTxx_Connector: Type: XT60H
J12 = XT60PW-M: Connector; Manufacturer_Name: Changzou Amass Elec; Datasheet Link: https://www.tme.eu/Document/9b8d0c5eb7094295f3d3112c214d3ade/XT60PW%20SPEC.pdf; Height: 8.4mm; Manufacturer_Part_Number: XT60PW-M
K1 = HF14FW/024-HSTF: Relay or Contactor; Manufacturer_Name: Hongfa; Datasheet Link: https://docs.rs-online.com/d608/0900766b81663c99.pdf; Height: 26.5mm; Manufacturer_Part_Number: HF14FW/024-HSTF
K2 = HF46F_024-HS1T: Relay or Contactor; Manufacturer_Name: Hongfa; Manufacturer_Part_Number: HF46F/024-HS1T; Datasheet Link: https://www.tme.com/Document/c87786c546bba5bb9984c9460ff2ec46/HF46F_en.pdf; Height: 15.6mm
L1 = SDRH104R-3R3NT: Inductor; Manufacturer_Name: TSA; Datasheet Link: http://www.tsasun.com/uploadfile/SDRH%20Series.pdf; Height: 4.1mm; Manufacturer_Part_Number: SDRH104R-3R3NT
LED1 = LED: Light Emitting Diode; Type2: DIP-HDR1*2-R; Type: 0805-G
LOW1 = 43045-2012: Connector; Manufacturer_Name: Molex; Datasheet Link: https://www.molex.com/pdm_docs/sd/430450612_sd.pdf; Height: 9.91mm; Manufacturer_Part_Number: 43045-2012; Mouser Part Number: 538-43045-2012; Mouser Price/Stock: https://www.mouser.co.uk/ProductDetail/Molex/43045-2012?qs=UeCeOHRHQeaNtH3DnNjSvA%3D%3D
LOW2 = 43045-1812: Connector; Manufacturer_Name: Molex; Datasheet Link: https://www.molex.com/pdm_docs/sd/430450612_sd.pdf; Height: 9.91mm; Manufacturer_Part_Number: 43045-1812; Mouser Part Number: 538-43045-1812; Mouser Price/Stock: https://www.mouser.co.uk/ProductDetail/Molex/43045-1812?qs=mrPiglD9aYKqQsv7cU%2F4pg%3D%3D
R1-R31 R33-R52 R55 R58-R61 R63 R65-R82 R86-R93 R95 R96 R98 R100-R114 R116-R142 R145 R146 R149 R152 = SMD_Resistor: Std Resistor; power rating: 100mW; voltage rating: 75V
  R1 R6 R10 R28 R30: Type: 0Ω
  R2-R5 R7 R8 R11-R13 R16-R19 R22 R29 R31 R33 R35-R38 R40-R42 R44 R46 R47 R58-R60 R63 R65 R67-R69 R71-R73 R78 R79 R86-R88 R90 R91 R93 R95 R98 R102 R104 R105 R107 R108 R117 R119 R120 R122 R123 R125 R126 R130 R138-R140 R142 R145: Type: 10K
  R9 R14 R15 R20 R21 R25 R34 R39 R43 R45 R48 R50 R61 R66 R70 R75 R76 R80 R89 R92 R96 R101 R106 R109 R121 R124 R127 R135 R141 R146: Type: 47K
  R23 R52 R81 R112 R149: Type: 4.7K
  R24 R49 R74 R100 R134: Type: 1.2K
  R26 R27 R51 R55 R77 R82 R103 R118 R137 R152: Type: 27
  R110 R111 R114 R116 R128 R129 R131-R133 R136: Type: 0
  R113: Type: 1.8K
R32 = SMD_Resistor: Std Resistor; Type: 3K
U2 U4-U7 = K78052MT_1000R4
ZDB1-ZDB10 = TVS_Diode_Bipolar: Bipolar Transient Voltage Supressor; value: 58V; Type: SMAJ58CA